# Altium schematic sheet SerialLvlConvert.SchDoc
size A; DocumentNumber: 7; SheetNumber: 7; SheetTotal: 8
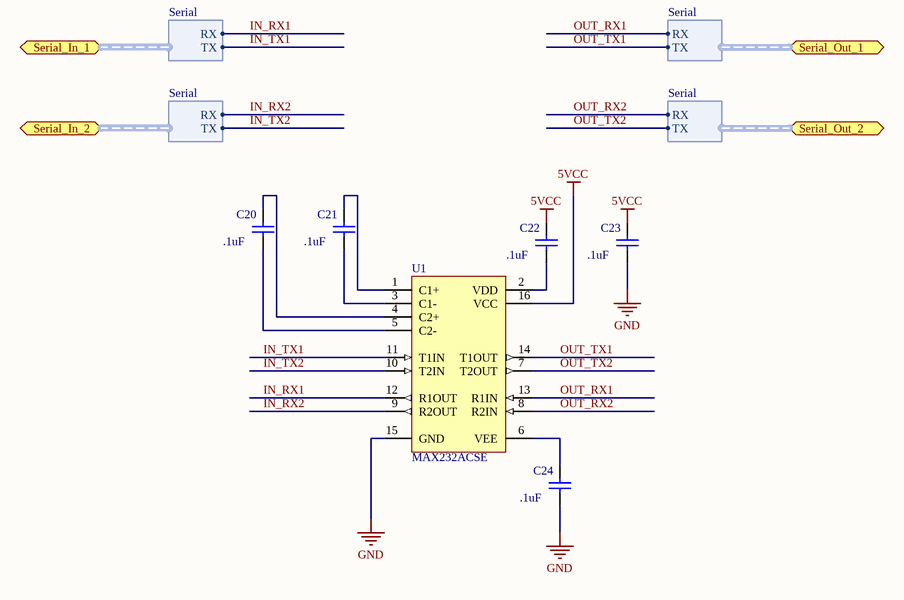
[diagram p0: SerialLvlConvert.SchDoc]

## Parts
C20  value .1uF  [0402]  (hidden comment: Cap Semi)
C21  value .1uF  [0402]  (hidden comment: Cap Semi)
C22  value .1uF  [0402]  (hidden comment: Cap Semi)
C23  value .1uF  [0402]  (hidden comment: Cap Semi)
C24  value .1uF  [0402]  (hidden comment: Cap Semi)
U1  MAX232ACSE  [NSO16_N]

## Ports
Serial_In_1 (harness Serial), Serial_In_2 (harness Serial), Serial_Out_1 (harness Serial), Serial_Out_2 (harness Serial)

## Harnesses
Serial: RX, TX

## Nets
5VCC: C22.1 C23.1 U1.16(VCC)
GND: C23.2 C24.2 U1.15(GND)
IN_RX1: U1.12(R1OUT) ; port Serial_In_1.RX
IN_RX2: U1.9(R2OUT) ; port Serial_In_2.RX
IN_TX1: U1.11(T1IN) ; port Serial_In_1.TX
IN_TX2: U1.10(T2IN) ; port Serial_In_2.TX
OUT_RX1: U1.13(R1IN) ; port Serial_Out_1.RX
OUT_RX2: U1.8(R2IN) ; port Serial_Out_2.RX
OUT_TX1: U1.14(T1OUT) ; port Serial_Out_1.TX
OUT_TX2: U1.7(T2OUT) ; port Serial_Out_2.TX
NetC20_1: C20.1 U1.4(C2+)
NetC20_2: C20.2 U1.5(C2-)
NetC21_1: C21.1 U1.1(C1+)
NetC21_2: C21.2 U1.3(C1-)
NetC22_2: C22.2 U1.2(VDD)
NetC24_1: C24.1 U1.6(VEE)

## Library data of the parts
C20-C24 = Cap Semi: Capacitor (Semiconductor SIM Model); Published: 8-Jun-2000; LatestRevisionDate: 17-Jul-2002; LatestRevisionNote: Re-released for DXP Platform.; PackageReference: C1206; Publisher: Altium Limited
U1 = MAX232ACSE: +5V Powered, Multi-Channel RS-232 Driver/Receiver; Published: 16-Jan-2001; LatestRevisionDate: 13-Apr-2006; LatestRevisionNote: IPC-7351 Footprint Added.; PackageReference: NSO16; Publisher: Altium Limited; PackageDescription: 16-Pin Small Outline Integrated Circuit 1.27 mm Pitch; Code_JEDEC: MS-012-AC; Code_IPC: SOIC127P600-16; ComponentLink1Description: Manufacturer Link; ComponentLink1URL: http://www.maxim-ic.com/; ComponentLink2Description: Datasheet; ComponentLink2URL: http://pdfserv.maxim-ic.com/en/ds/MAX220-MAX249.pdf